# EAGLE design sound-board (EAGLE 7.7.0)
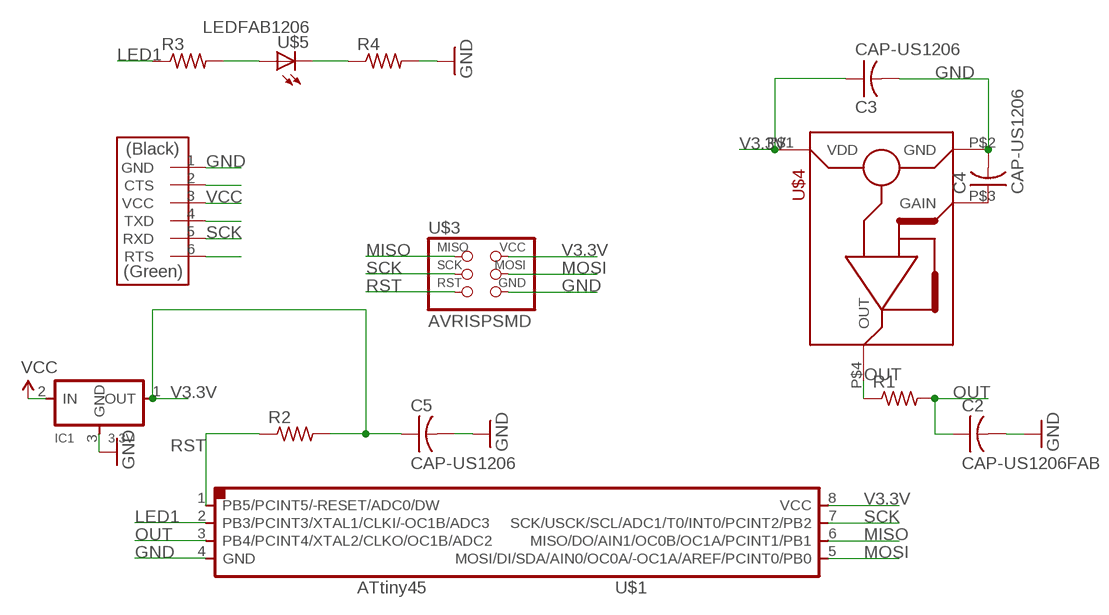
[diagram p0: schematic, sheet 1]

## Parts
C2  CAP-US1206FAB  [C1206FAB]
C3  CAP-US1206  [C1206]
C4  CAP-US1206  [C1206]
C5  CAP-US1206  [C1206]
IC1  3.3V  REGULATORSOT23  [SOT23]
R1  RES-US1206  [R1206]
R2  RES-US1206  [R1206]
R3  RES-US1206FAB  [R1206FAB]
R4  RES-US1206FAB  [R1206FAB]
U$1  ATTINY45SI  [SOIC8]
U$2  FTDI-SMD-HEADER  [1X06SMD]
U$3  AVRISPSMD  [2X03SMD]
U$4  MEMS_MIC_SPU0414HR5H-SB  [CSP-4PIN]
U$5  LEDFAB1206  [LED1206FAB]

## Nets
GAIN: C4.1 U$4.P$3(GAIN)
GND: C2.2 C3.2 C4.2 C5.2 IC1.3(GND) R4.2 U$1.4(GND) U$2.1(GND) U$3.6(GND) U$4.P$2(GND)
LED1: R3.1 U$1.2(PB3/PCINT3/XTAL1/CLKI/-OC1B/ADC3)
MISO: U$1.6(MISO/DO/AIN1/OC0B/OC1A/PCINT1/PB1) U$3.1(MISO)
MOSI: U$1.5(MOSI/DI/SDA/AIN0/OC0A/-OC1A/AREF/PCINT0/PB0) U$3.4(MOSI)
N$1: R3.2 U$5.1(A)
N$2: U$2.2(CTS)
N$3: R4.1 U$5.2(C)
N$4: U$2.4(TXD)
N$9: U$2.6(RTS)
OUT: C2.1 R1.1 R1.2 U$1.3(PB4/PCINT4/XTAL2/CLKO/OC1B/ADC2) U$4.P$4(OUT)
RST: R2.1 U$1.1(PB5/PCINT5/-RESET/ADC0/DW) U$3.5(RST)
SCK: U$1.7(SCK/USCK/SCL/ADC1/T0/INT0/PCINT2/PB2) U$2.5(RXD) U$3.3(SCK)
V3.3V: C3.1 C5.1 IC1.1(OUT) R2.2 U$1.8(VCC) U$3.2(VCC) U$4.P$1(VDD)
VCC: IC1.2(IN) U$2.3(VCC)

## Library data of the parts
C2-C5 = fab-library:CAP-US
IC1 = fab-library:REGULATOR
R1-R4 = fab-library:RES-US: Resistor (US Symbol) Variants with postfix FAB are widened to allow the routing of internal traces
U$1 = fab-library:ATTINY45
U$2 = fab-library:FTDI-SMD-HEADER
U$3 = fab-library:AVRISP
U$4 = fab-library:MEMS_MIC_SPU0414HR5H-SB
U$5 = fab-library:LED: LED

## Board
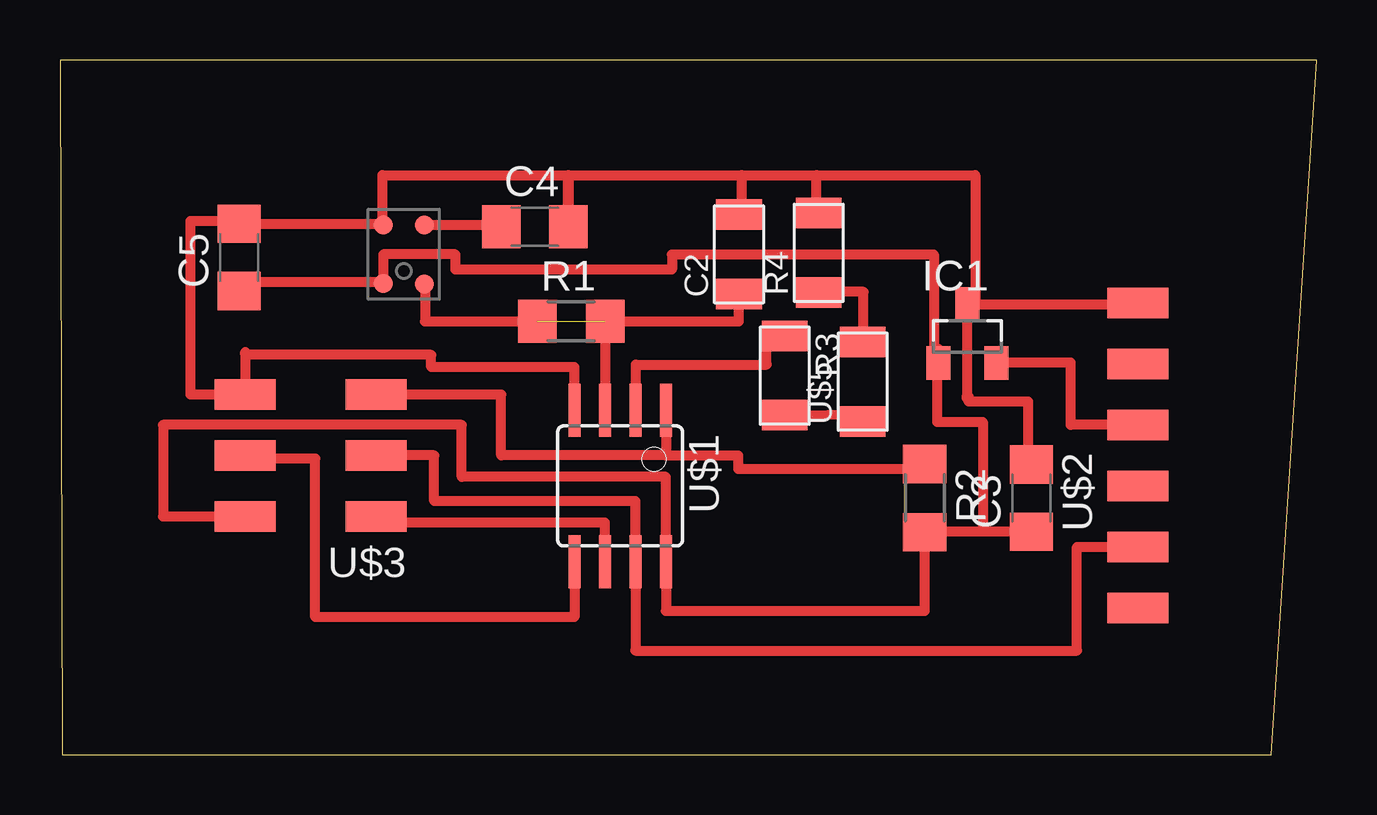
[diagram p1: board, top side]
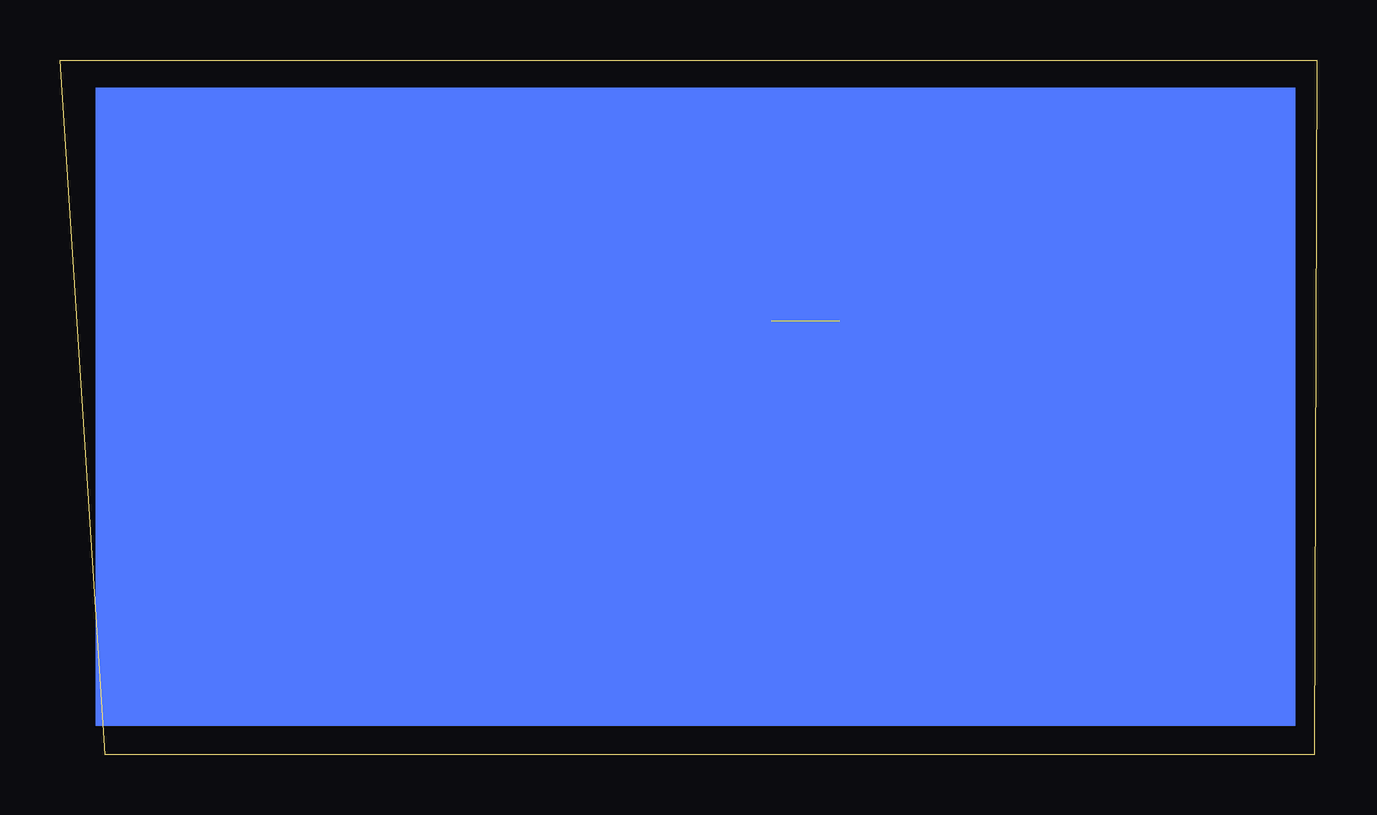
[diagram p2: board, bottom side, seen from below]

Size 52.38 x 28.94 mm. Coordinates in mm from the lower left corner, seen from the top.
Outline: 0.09,0 50.48,0 52.37,28.94 0,28.94 0.09,0
Copper layers (1*16): Top 0.035mm / dielectric 1.5mm / Bottom 0.035mm
Design rules "default": minimum track width 10mil, minimum drill 24mil, track to track 8mil, track to pad 8mil, pad to pad 8mil, via to via 8mil, smd to smd 8mil, copper to edge 40mil, drill to drill 8mil, minimum pad ring 10mil, minimum via ring 8mil, stop-mask expansion 4mil, vias tented up to drill 0mil, thermal gap 10mil

### Footprints (pad centres in the part's own frame; a part is rotated, then mirrored left to right if it is on the bottom)
C1206FAB = smd 1.27 x 1.905: 1 -1.651,0; 2 1.651,0
C1206 = smd 1.6 x 1.8: 1 -1.4,0; 2 1.4,0
SOT23 = smd 1 x 1.4: 1 -1.204,-1.1; 2 1.204,-1.1; 3 0,1.354
R1206 = smd 1.6 x 1.803: 1 -1.422,0; 2 1.422,0
R1206FAB = smd 1.27 x 1.905: 1 -1.651,0; 2 1.651,0
SOIC8 = smd 0.5 x 2.2: 1 -1.905,-3.154; 2 -0.645,-3.154; 3 0.625,-3.154; 4 1.895,-3.154; 5 1.905,3.154; 6 0.635,3.154; 7 -0.635,3.154; 8 -1.905,3.154
1X06SMD = smd 2.54 x 1.27: 1 0,6.35; 2 0,3.81; 3 0,1.27; 4 0,-1.27; 5 0,-3.81; 6 0,-6.35
2X03SMD = smd 2.54 x 1.27: 1 -2.54,2.54; 2 2.92,2.54; 3 -2.54,0; 4 2.92,0; 5 -2.54,-2.54; 6 2.92,-2.54
CSP-4PIN = smd 0.8 x 0.8: P$1 0.855,1.215; P$2 0.85,-1.23; P$3 -0.85,-1.23; P$4 -0.85,1.23
LED1206FAB = smd 1.27 x 1.905: 1 -1.651,0; 2 1.651,0

### Placement (x,y rotation side)
C2  28.3,20.84 90 top
C3  40.49,10.68 90 top
C4  19.79,21.99 0 top
C5  7.47,20.72 90 top
IC1  37.82,17.41 0 top
R1  21.31,18.05 0 top
R2  36.05,10.68 270 top
R3  30.2,15.79 270 top
R4  31.63,20.91 90 top
U$1  23.35,11.19 180 top
U$2  44.94,12.46 0 top
U$3  10.65,12.46 180 top
U$4  14.33,20.84 180 top
U$5  33.45,15.54 90 top

### Tracks (layer width: path | path; a pad name or v marks a point on that pad's centre or on a via)
GAIN
  Top 0.406: U$4.P$3 18.39,22.07 C4.1
GND
  Top 0.406: 21.19,24.15 13.44,24.15 13.44,22.07 U$4.P$2 13.48,22.12 C5.2 7.47,22.24 5.44,22.24 5.44,15 U$3.6 7.73,16.78 7.72,16.78 7.72,16.65 15.47,16.65 15.47,16.14 21.44,16.14 U$1.4 | 21.19,24.15 | 21.19,24.15 C4.2 21.19,24.15 | 21.19,24.15 28.43,24.15 | C2.2 28.43,22.5 28.43,24.15 | C3.2 40.36,12.08 40.36,14.71 37.87,14.71 37.87,14.91 37.79,14.91 37.79,14.85 37.82,14.85 IC1.3 | 28.43,24.15 31.54,24.15 | 31.54,24.15 38.15,24.15 38.15,18.77 IC1.3 | IC1.3 44.94,18.77 U$2.1 | R4.2 31.54,22.56 31.54,24.15
LED1
  Top 0.406: U$1.2 24.01,14.35 24.01,16.25 29.45,16.25 29.45,17.45 30.2,17.45 R3.1
MISO
  Top 0.406: U$1.6 22.71,9.67 13.19,9.67 U$3.1
MOSI
  Top 0.406: U$1.5 21.44,5.73 10.65,5.73 10.65,12.34 7.73,12.34 U$3.4
N$1
  Top 0.406: R3.2 33.71,14.18 33.71,14.2 33.75,14.2 U$5.1
N$3
  Top 0.406: U$5.2 33.49,17.19 33.49,19.28 31.63,19.28 R4.1
OUT  (1 unrouted)
  Top 0.406: U$4.P$4 15.22,19.61 15.22,18.05 R1.1 | U$1.3 22.72,18.05 R1.2 28.3,18.05 C2.1
RST
  Top 0.406: 25.25,12.46 18.39,12.46 18.39,15 U$3.5 | U$1.1 25.25,12.46 | 25.25,12.46 28.27,12.46 28.27,11.91 36.05,11.91 R2.1
SCK
  Top 0.406: U$3.3 15.6,12.46 15.6,10.56 23.98,10.56 U$1.7 23.98,4.33 42.4,4.33 42.4,8.65 U$2.5
V3.3V
  Top 0.406: U$3.2 4.3,9.92 4.3,13.73 16.74,13.73 16.74,11.57 25.25,11.57 U$1.8 25.25,5.99 36.05,5.99 R2.2 36.05,9.29 38.46,9.29 | C5.1 7.98,19.32 7.98,19.7 13.47,19.7 U$4.P$1 13.47,20.84 16.49,20.84 16.49,20.21 25.5,20.21 25.5,20.84 36.43,20.84 36.43,16.91 36.55,16.91 | 36.55,16.91 36.62,16.91 IC1.1 | 36.55,16.91 36.55,13.86 38.46,13.86 38.46,9.29 | C3.1 38.46,9.29
VCC
  Top 0.406: U$2.3 42.13,13.73 42.13,16.34 39.03,16.34 IC1.2
(copper drawn outside any net)
  shapes: Bottom area x1